# Altium project Program_Counter.PrjPcb
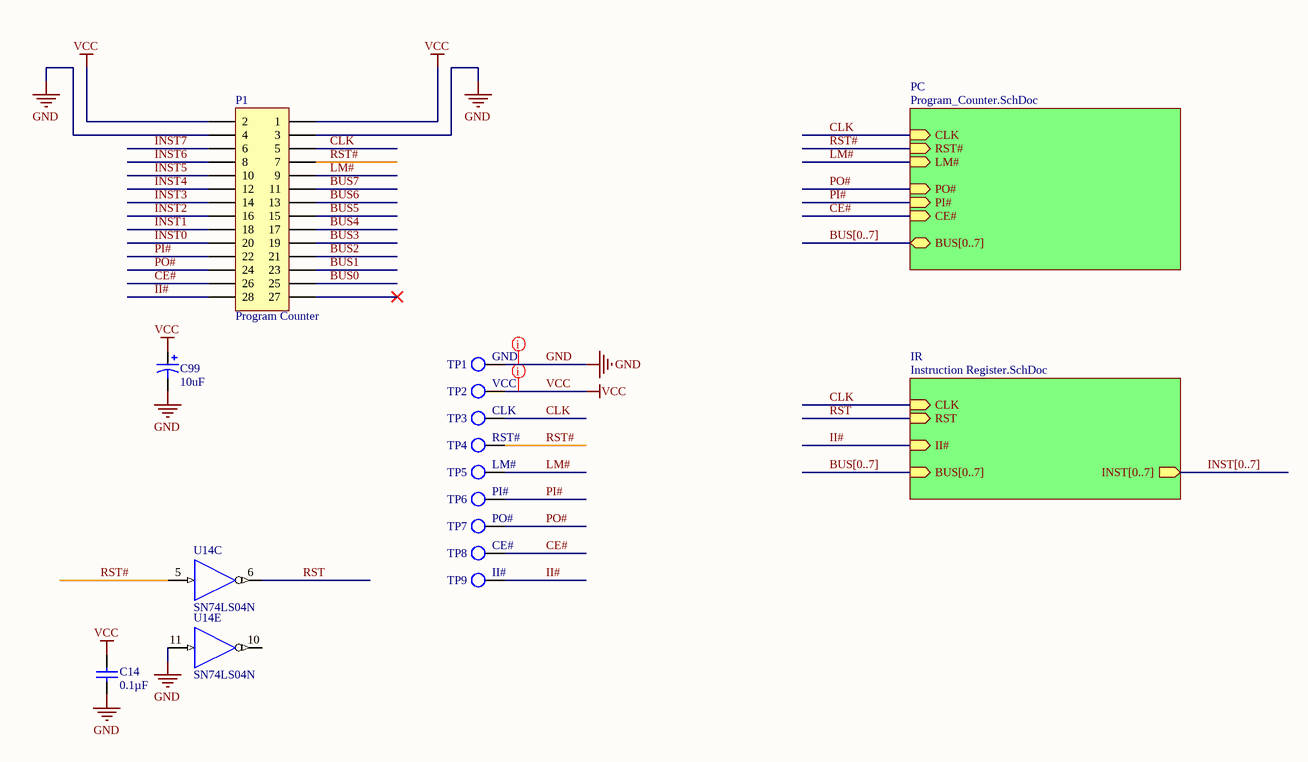
[diagram p0: Top.SchDoc]
2 sheets, 17 parts. Net scope: hierarchical (ports join the sheet entries above them; power ports are global).
Board file: Program_Counter.PcbDoc
Sheets:
  Top.SchDoc
    IR = Instruction Register.SchDoc

## Sheet Top.SchDoc
size B; Author: E. Sims; Organization: Let's Build Rockets Inc.; SheetNumber: 1; SheetTotal: 3

### Parts
C14  Capacitance: 0.1µF  [VISH-K104K15X7RF5TL2]  (hidden comment: K104K15X7RF5TL2)
C99  value 10uF  [C5x7]  (hidden comment: Cap Pol5)
P1  Program Counter  [HDR2X14H]
TP1  GND  [KSTN-5011_V]  (no BOM)
TP2  VCC  [KSTN-5011_V]  (no BOM)
TP3  CLK  [KSTN-5011_V]  (no BOM)
TP4  RST#  [KSTN-5011_V]  (no BOM)
TP5  LM#  [KSTN-5011_V]  (no BOM)
TP6  PI#  [KSTN-5011_V]  (no BOM)
TP7  PO#  [KSTN-5011_V]  (no BOM)
TP8  CE#  [KSTN-5011_V]  (no BOM)
TP9  II#  [KSTN-5011_V]  (no BOM)
U14  SN74LS04N  [N014]  (parts C,E of 6)

### Sub-sheets
IR = Instruction Register.SchDoc: CLK (in), RST (in), BUS[0..7] (in), II# (in), INST[0..7] (out)
PC = Program_Counter.SchDoc (file not in this document): CLK (in), PO# (in), RST# (in), BUS[0..7] (bidir), CE# (in), PI# (in), LM# (in)

### Nets
GND: C14.2 C99.2 P1.3 P1.4 TP1.1 U14.7(GND) U14.11(A)
VCC: C14.1 C99.1 P1.1 P1.2 TP2.1 U14.14(VCC)
BUS0: P1.25
BUS1: P1.23
BUS2: P1.21
BUS3: P1.19
BUS4: P1.17
BUS5: P1.15
BUS6: P1.13
BUS7: P1.11
CE#: P1.26 TP8.1 ; sheet PC/CE#
CLK: P1.5 TP3.1 ; sheet PC/CLK, sheet IR/CLK
II#: P1.28 TP9.1 ; sheet IR/II#
INST0: P1.20
INST1: P1.18
INST2: P1.16
INST3: P1.14
INST4: P1.12
INST5: P1.10
INST6: P1.8
INST7: P1.6
LM#: P1.9 TP5.1 ; sheet PC/LM#
PI#: P1.22 TP6.1 ; sheet PC/PI#
PO#: P1.24 TP7.1 ; sheet PC/PO#
RST: U14.6(Y) ; sheet IR/RST
RST#: P1.7 TP4.1 U14.5(A) ; sheet PC/RST#

Not connected (* = marked no-connect by the designer): P1 27*; U14 10(Y)

### Buses and harness runs
bus BUS[0..7] = sheet IR/BUS[0..7]
bus BUS[0..7] = sheet PC/BUS[0..7]
bus INST[0..7] = sheet IR/INST[0..7]

### Layout directives
rule Width Constraint [Pref Width = 20mil    Min Width = 20mil    Max Width = 50mil]; rule Routing Via Style [Pref Size = 35mil    Pref Hole Size = 20mil]; net class PWR: GND, VCC

### Notes on the sheet
- Let's Build Rocket's Inc. Modular Paylaod System Based on TMP-010 Rev
  For more information visit https://github.com/LetsBuildRockets/Modular-Payload-System
  This work is licensed under CC BY-NC 4.0. To view a copy of this license, visit https://creativecommons.org/licenses/by-nc/4.0
- Title
- Size:
- Date:
- Assembly Variant:
- B
- Number:
- Time:
- Revision:
- Sheet
- of
- Author:
- File:

### Library data of the parts
C14 = CMP-2000-06508-1: Ceramic Capacitor, 100 nF, +/- 10%, 50 V, -55 to 125 degC, 2-Pin THD, RoHS, Tape and Reel; Manufacturer: Vishay; Other Names: BC1084CT; Catalog Drawings: Mono-KapSide2-15_5.58Mono-KapSide1_15; Temperature Coefficient: X7R; Voltage - Rated: 50V; Online Catalog: Mono-Kap™Series; Size / Dimension: 0.157"Lx0.098"W(4.00mmx2.50mm); Operating Temperature: -55°C~125°C; Family: CeramicCapacitors; Manufacturer URL: http://www.vishay.com/; Standard Package: 1; Thickness (Max): -; Ratings: -; Datasheet Version: 08/2013; Package Description: 2-Pin Through Hole Device, Body 4 x 2.6 mm; Mounting Type: ThroughHole; Features: -; Lead Spacing: 0.098"(2.50mm); Tolerance: ±10%; Category: Capacitors; Mounting Technology: ThroughHole; Lead Style: Straight; Datasheet URL: http://www.vishay.com/docs/45171/kseries.pdf; Applications: GeneralPurpose; Package / Case: Radial; Height - Seated (Max): 0.220"(5.58mm); Package Reference: K104K15X7RF5TL2; Series: Mono-Kap™K; Packaging: CutTape(CT)
C99 = Cap Pol5: Polarized Capacitor; Published: 8-Jun-2000; LatestRevisionDate: 17-Jul-2002; LatestRevisionNote: Re-released for DXP Platform.; PackageReference: POLAR0.8; Publisher: Altium Limited; PackageDescription: Polarized Capacitor; 2 Leads
P1 = Header 14X2H: Header, 14-Pin, Dual row, Right Angle; System: Connector; LatestRevisionDate: 17-Jul-2002; LatestRevisionNote: Re-released for DXP Platform.; Publisher: Altium Limited
TP1-TP9 = TP
U14 = SN74LS04N: Hex Inverter; Published: 8-Jun-2000; LatestRevisionDate: 04-Mar-2005; LatestRevisionNote: Stylized 3D Model Added.; DatasheetVersion: Mar-1988; PackageVersion: Oct-1995; PackageReference: N014; Publisher: Altium Limited; PackageDescription: DIP; 14 Leads; Row Spacing 7.62 mm; Pitch 2.54 mm; ComponentLink1Description: Manufacturer Link; ComponentLink1URL: http://www.ti.com/; ComponentLink2Description: Datasheet; ComponentLink2URL: http://www-s.ti.com/sc/ds/sn74ls04.pdf

## Sheet Instruction Register.SchDoc
size A; Author: E. Sims; Organization: Let's Build Rockets Inc.; SheetNumber: 3; SheetTotal: 3
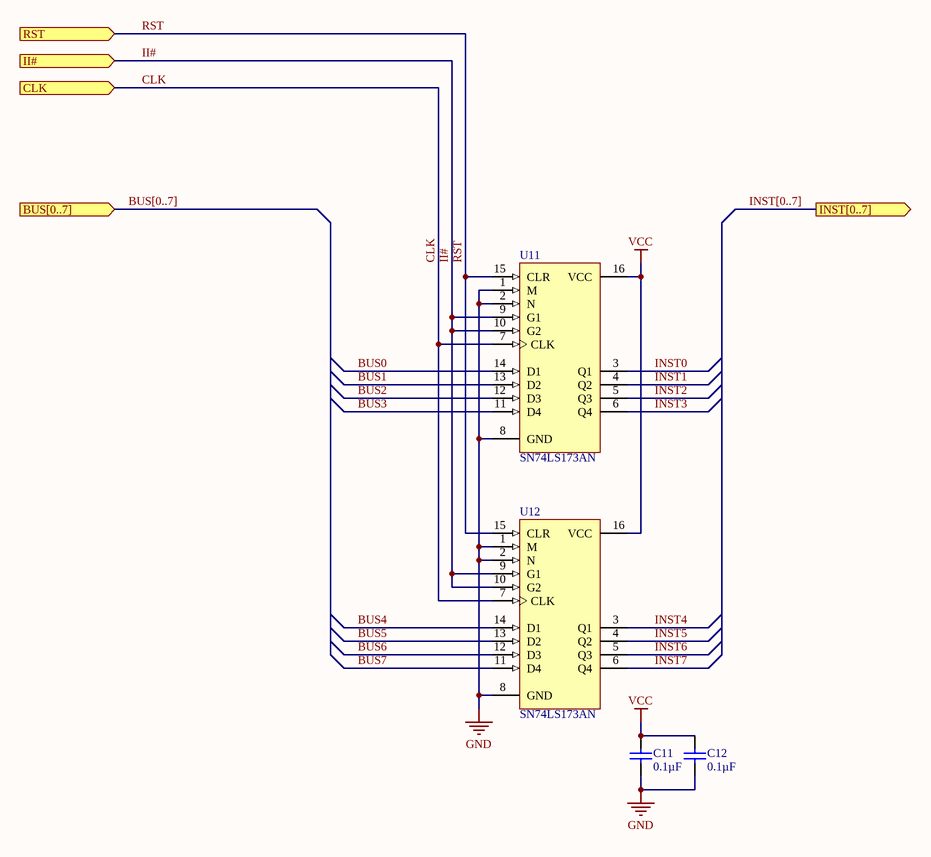
[diagram p1: Instruction Register.SchDoc]

### Parts
C11  Capacitance: 0.1µF  [VISH-K104K15X7RF5TL2]  (hidden comment: K104K15X7RF5TL2)
C12  Capacitance: 0.1µF  [VISH-K104K15X7RF5TL2]  (hidden comment: K104K15X7RF5TL2)
U11  SN74LS173AN  [N016D]
U12  SN74LS173AN  [N016D]

### Ports
BUS[0..7] (in), CLK (in), II# (in), INST[0..7] (out), RST (in)

### Nets
GND: C11.2 C12.2 U11.1(M) U11.2(N) U11.8(GND) U12.1(M) U12.2(N) U12.8(GND)
VCC: C11.1 C12.1 U11.16(VCC) U12.16(VCC)
BUS0: U11.14(D1)
BUS1: U11.13(D2)
BUS2: U11.12(D3)
BUS3: U11.11(D4)
BUS4: U12.14(D1)
BUS5: U12.13(D2)
BUS6: U12.12(D3)
BUS7: U12.11(D4)
CLK: U11.7(CLK) U12.7(CLK) ; port CLK
II#: U11.9(G1) U11.10(G2) U12.9(G1) U12.10(G2) ; port II#
INST0: U11.3(Q1)
INST1: U11.4(Q2)
INST2: U11.5(Q3)
INST3: U11.6(Q4)
INST4: U12.3(Q1)
INST5: U12.4(Q2)
INST6: U12.5(Q3)
INST7: U12.6(Q4)
RST: U11.15(CLR) U12.15(CLR) ; port RST

### Buses and harness runs
bus BUS[0..7] = port BUS[0..7]
bus INST[0..7] = port INST[0..7]

### Notes on the sheet
- Let's Build Rocket's Inc. Modular Paylaod System Based on TMP-010 Rev
  For more information visit https://github.com/LetsBuildRockets/Modular-Payload-System
  This work is licensed under CC BY-NC 4.0. To view a copy of this license, visit https://creativecommons.org/licenses/by-nc/4.0
- Title
- Size:
- Date:
- Assembly Variant:
- B
- Number:
- Time:
- Revision:
- Sheet
- of
- Author:
- File:

### Library data of the parts
C11 C12 = CMP-2000-06508-1: as C14 on sheet Top; Size / Dimension: 0.157"Lx0.098"W(4.00mmx2.50mm); Operating Temperature: -55°C~125°C; Family: CeramicCapacitors; Manufacturer URL: http://www.vishay.com/; Standard Package: 1; Thickness (Max): -; Ratings: -; Datasheet Version: 08/2013; Package Description: 2-Pin Through Hole Device, Body 4 x 2.6 mm; Mounting Type: ThroughHole; Features: -; Lead Spacing: 0.098"(2.50mm); Tolerance: ±10%; Category: Capacitors; Mounting Technology: ThroughHole; Lead Style: Straight; Datasheet URL: http://www.vishay.com/docs/45171/kseries.pdf; Applications: GeneralPurpose; Package / Case: Radial; Height - Seated (Max): 0.220"(5.58mm); Package Reference: K104K15X7RF5TL2; Series: Mono-Kap™K; Packaging: CutTape(CT)
U11 U12 = SN74LS173AN: 4-Bit D-Type Register with 3-State Outputs; Published: 8-Jun-2000; LatestRevisionDate: 04-Mar-2005; LatestRevisionNote: Stylized 3D Model Added.; DatasheetVersion: Mar-1988; PackageVersion: Oct-1995; PackageReference: N016D; Publisher: Altium Limited; PackageDescription: DIP; 16 Leads; Row Spacing 7.62 mm; Pitch 2.54 mm; Code_JEDEC: MS-001-BB; ComponentLink1Description: Manufacturer Link; ComponentLink1URL: http://www.ti.com/; ComponentLink2Description: Datasheet; ComponentLink2URL: http://www-s.ti.com/sc/ds/sn74ls173a.pdf

## Nets that join several sheets
GND: Top (7 pins), Instruction Register (8 pins)
VCC: Top (6 pins), Instruction Register (C11.1 C12.1 U11.16 U12.16)
BUS0: Top (P1.25), Instruction Register (U11.14)
BUS1: Top (P1.23), Instruction Register (U11.13)
BUS2: Top (P1.21), Instruction Register (U11.12)
BUS3: Top (P1.19), Instruction Register (U11.11)
BUS4: Top (P1.17), Instruction Register (U12.14)
BUS5: Top (P1.15), Instruction Register (U12.13)
BUS6: Top (P1.13), Instruction Register (U12.12)
BUS7: Top (P1.11), Instruction Register (U12.11)
CLK: Top (P1.5 TP3.1), Instruction Register (U11.7 U12.7)
II#: Top (P1.28 TP9.1), Instruction Register (U11.9 U11.10 U12.9 U12.10)
INST0: Top (P1.20), Instruction Register (U11.3)
INST1: Top (P1.18), Instruction Register (U11.4)
INST2: Top (P1.16), Instruction Register (U11.5)
INST3: Top (P1.14), Instruction Register (U11.6)
INST4: Top (P1.12), Instruction Register (U12.3)
INST5: Top (P1.10), Instruction Register (U12.4)
INST6: Top (P1.8), Instruction Register (U12.5)
INST7: Top (P1.6), Instruction Register (U12.6)
RST: Top (U14.6), Instruction Register (U11.15 U12.15)